# EAGLE design working (EAGLE 9.6.2)
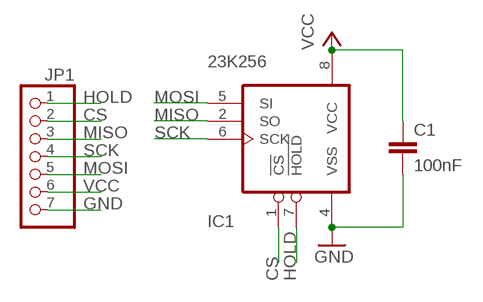
[diagram p0: schematic, sheet 1]

## Parts
C1  100nF  CAPC805  [C805]
IC1  23K256  [SOIC8]
JP1  PINHD-1X7  [1X07]

## Nets
CS: IC1.1(!CS) JP1.2
GND: C1.2 IC1.4(VSS) JP1.7
HOLD: IC1.7(!HOLD) JP1.1
MISO: IC1.2(SO) JP1.3
MOSI: IC1.5(SI) JP1.5
SCK: IC1.6(SCK) JP1.4
VCC: C1.1 IC1.8(VCC) JP1.6

## Library data of the parts
C1 = dp_devices:CAP
IC1 = dp_devices:23K256: 256K SPI Bus Low power Serial SRAM
JP1 = pinhead - Copy:PINHD-1X7: PIN HEADER

## Board
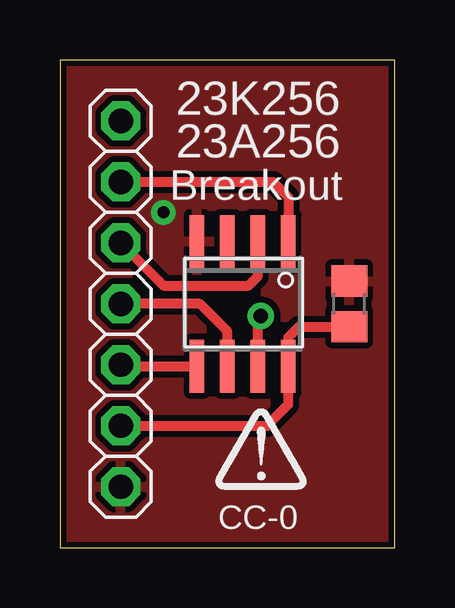
[diagram p1: board, top side]
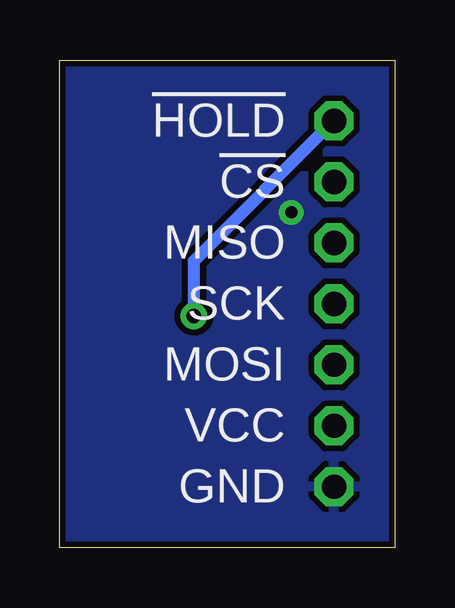
[diagram p2: board, bottom side, seen from below]

Size 13.97 x 20.32 mm. Coordinates in mm from the lower left corner, seen from the top.
Outline: 0,20.32 0,0 13.97,0 13.97,20.32 0,20.32
Copper layers (1*16): Top 0.035mm / dielectric 1.5mm / Bottom 0.035mm
Design rules "SparkFun- modified": minimum track width 8mil, minimum drill 20mil, track to track 8mil, track to pad 8mil, pad to pad 8mil, via to via 8mil, smd to smd 8mil, copper to edge 10mil, drill to drill 8mil, minimum pad ring 12mil, minimum via ring 10mil, stop-mask expansion 2mil, vias tented up to drill 25mil, thermal gap 10mil

### Footprints (pad centres in the part's own frame; a part is rotated, then mirrored left to right if it is on the bottom)
C805 = smd 1.3 x 1.5: 1 -0.95,0; 2 0.95,0
SOIC8 = smd 0.6 x 2.2: 1 -1.905,-2.6; 2 -0.635,-2.6; 3 0.635,-2.6; 4 1.905,-2.6; 5 1.905,2.6; 6 0.635,2.6; 7 -0.635,2.6; 8 -1.905,2.6
1X07 = drill 1.016 octagon: 1 -7.62,0; 2 -5.08,0; 3 -2.54,0; 4 0,0; 5 2.54,0; 6 5.08,0; 7 7.62,0

### Placement (x,y rotation side)
C1  12.06,10.16 90 top
IC1  7.62,10.16 180 top
JP1  2.54,10.16 270 top
U$1  [DP_LOGO]  8.38,3.05 0 top

### Tracks (layer width: path | path; a pad name or v marks a point on that pad's centre or on a via)
CS
  Top 0.406: JP1.2 8.89,15.24 9.53,14.61 IC1.1
GND  (via drill 0.51)
  other vias: 4.32,13.97
  pour Bottom (isolate 0.254): 0,20.32 0,0 13.97,0 13.97,20.32
  pour Top (isolate 0.254): 0,20.32 0,0 13.97,0 13.97,20.32
HOLD  (via drill 0.6)
  Top 0.406: IC1.7 8.26,9.53 v8.38,9.65
  Bottom 0.508: v8.38,9.65 8.38,11.94 JP1.1
MISO
  Top 0.406: JP1.3 4.32,10.92 7.87,10.92 8.26,11.3 IC1.2
MOSI
  Top 0.406: IC1.5 2.54,7.56 JP1.5
SCK
  Top 0.406: JP1.4 5.84,10.16 6.99,9.02 IC1.6
VCC
  Top 0.406: JP1.6 8.64,5.08 9.53,5.97 IC1.8 9.53,8.76 9.97,9.21 C1.1

### Text on the board
tNames: 23K256 | 23A256 | Breakout | CC-0
bNames: !HOLD | !CS | MISO | SCK | MOSI | VCC | GND
tDocu: !HOLD | !CS | MISO | SCK | MOSI | VCC | GND